# EasyEDA Pro project ELECAP.eprj, board PCB2
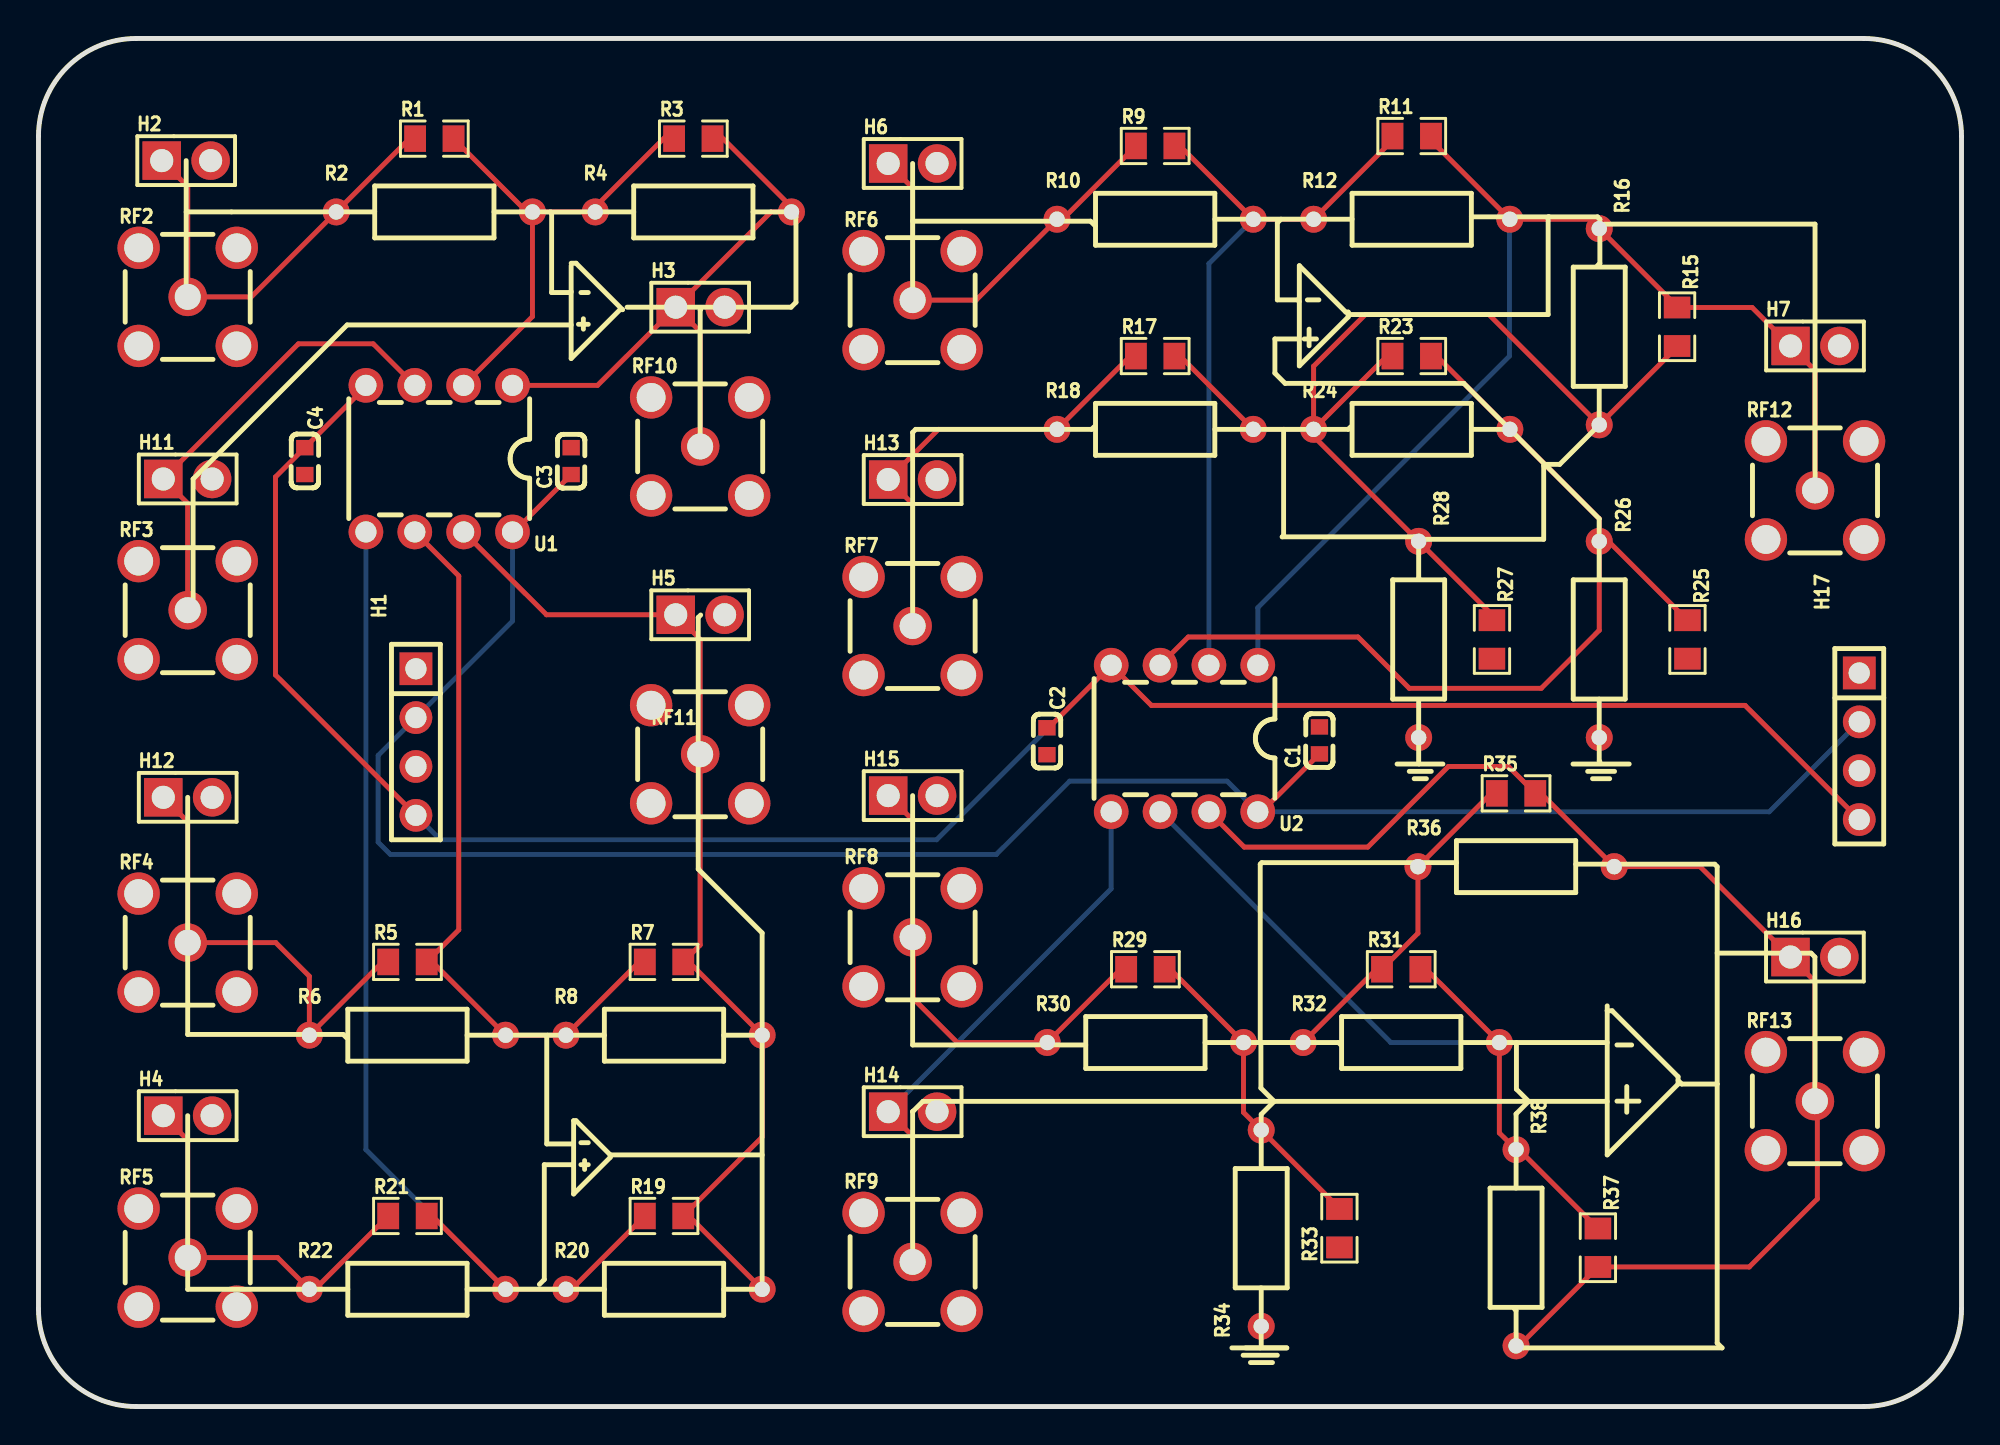
[diagram p4: board, top side]
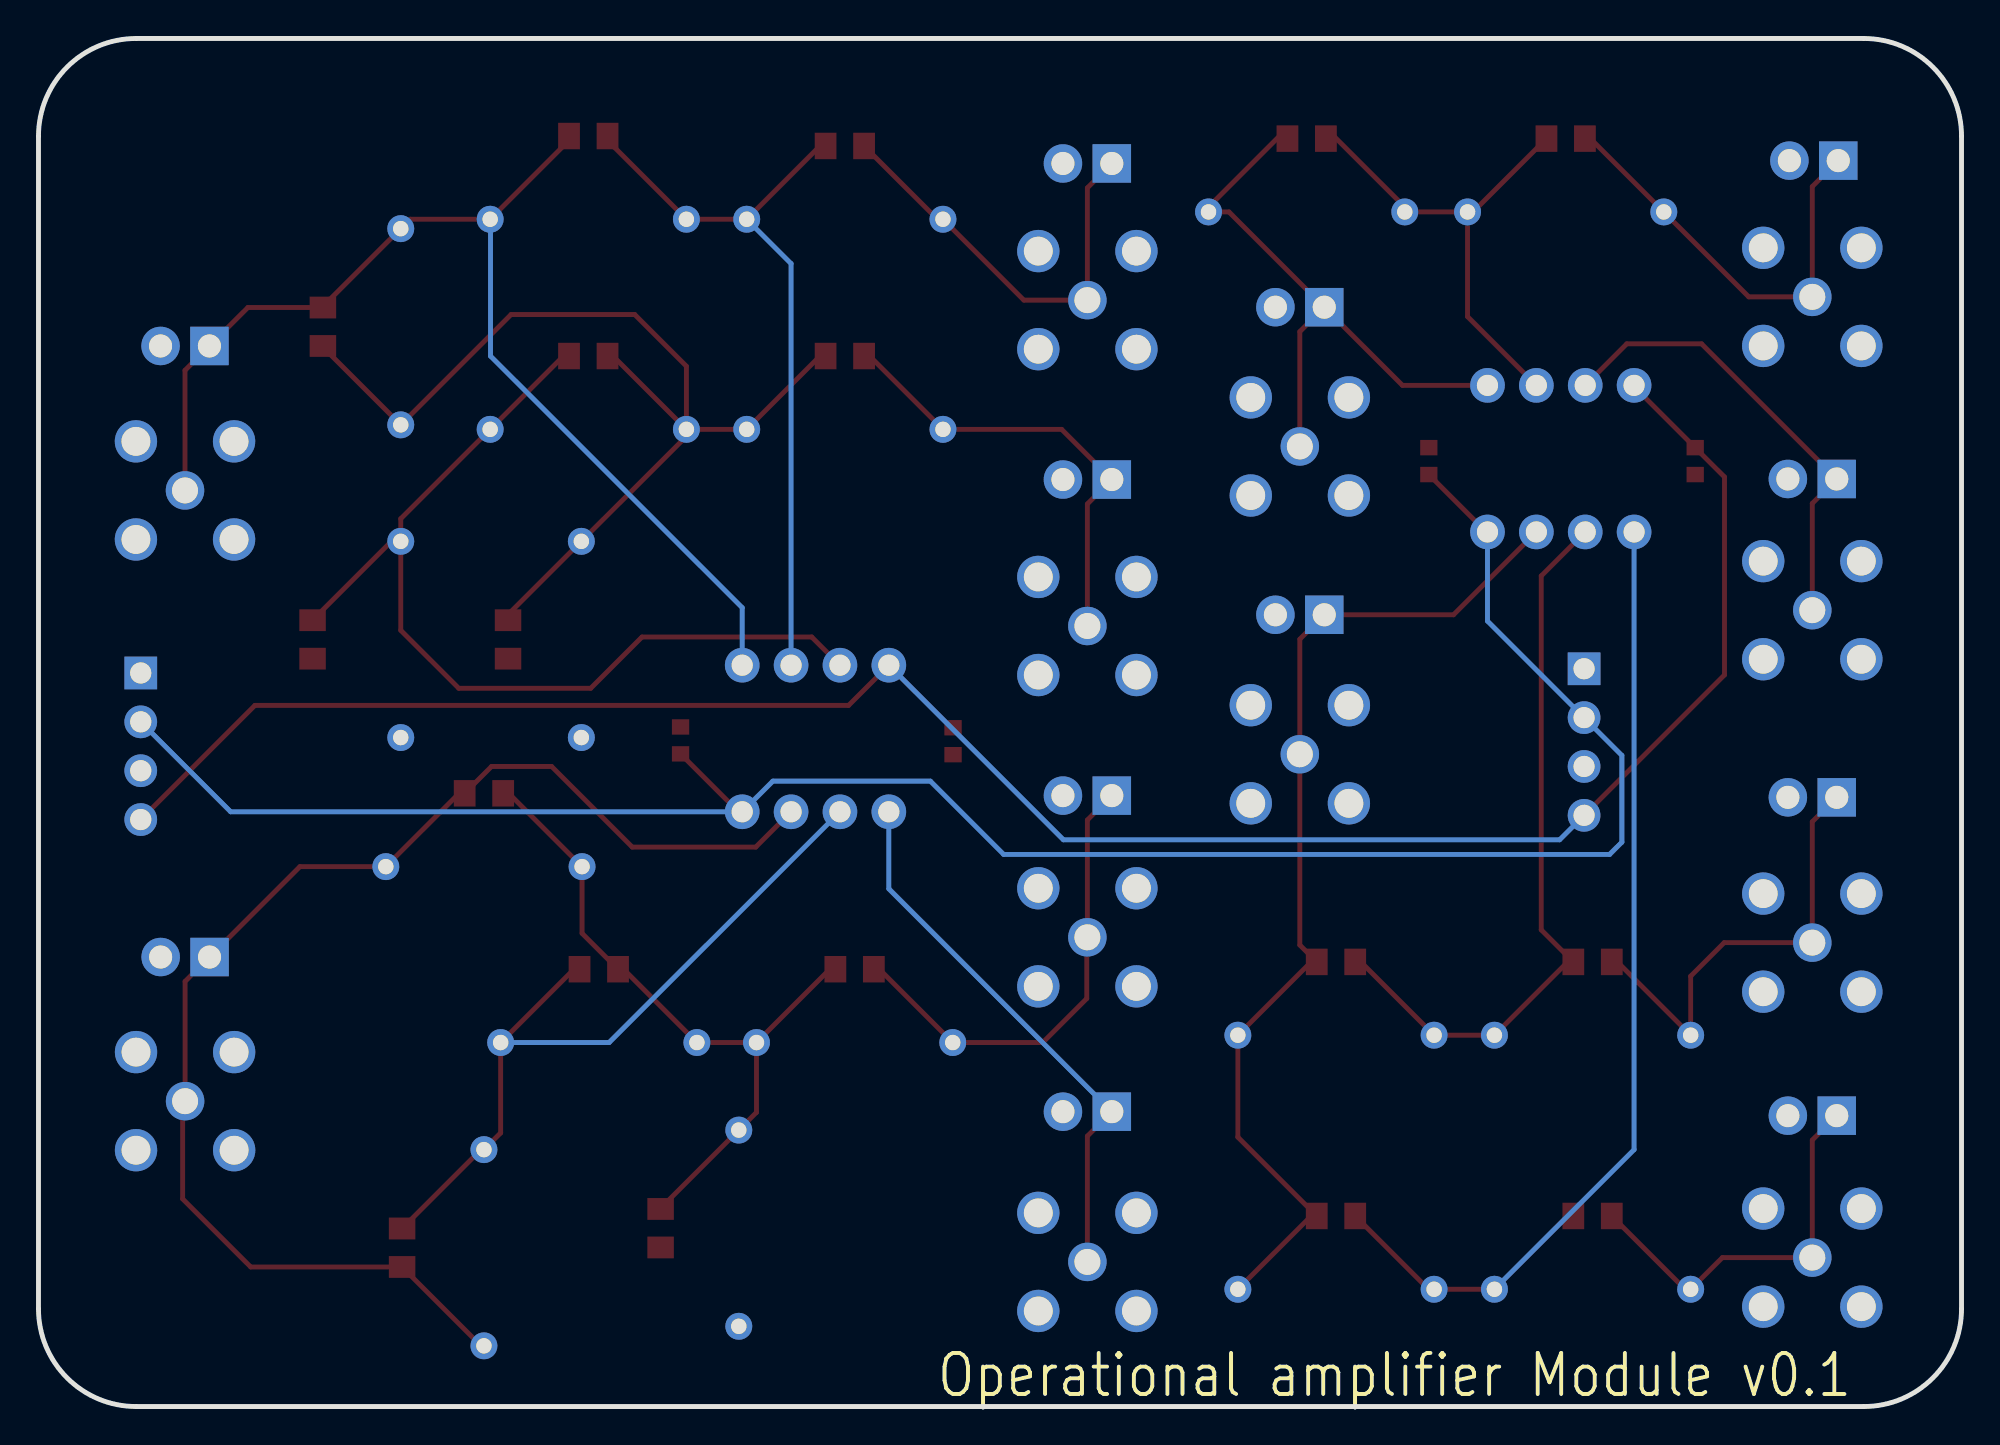
[diagram p5: board, bottom side, seen from below]

Outline 99.95 x 71.12 mm; copper layers: Top Layer, Inner9, Inner10, Inner11, Inner12, Inner13, Inner14, Inner15, Inner16, Inner17, Inner18, Inner19, Inner20, Inner21, Inner22, Inner23, Inner24, Inner25, Inner26, Inner27, Inner28, Inner29, Inner30, Bottom Layer. Coordinates in mm from the lower left corner of the outline.
Outline path: 0,66.04 0,5.08 arc(1.49,1.49) 5.08,0 94.87,0 arc(98.46,1.49) 99.95,5.08 99.95,66.04 arc(98.46,69.63) 94.87,71.12 5.08,71.12 arc(1.49,69.63) 0,66.04
Stack: Top Layer 0.035mm / Dielectric1 1.51mm FR4 er 4.5 / Bottom Layer 0.035mm

## Design rules (mm)
template: JLCPCB Capability(Two Layers Board)
spacing copperThickness1oz (default): track to track 0.102, other pairs 0.152 to 0.3
spacing copperThickness2oz: track to track 0.203, other pairs 0.152 to 0.3
track width copperThickness1oz (default): min 0.127, default 0.254, max 2.54
track width copperThickness2oz: min 0.203, default 0.254, max 2.54
differential pair differentialPair (default): width min 0.127, default 0.254, max 2.54; gap min 0.152, default 0.152
via viaSize (default): diameter min 0.5, default 0.61, max 10; hole min 0.3, default 0.305, max 6.3

## Placement (name value [footprint] x y rotation side)
C1  100nF  [C0603]  66.58 34.63 90 top
C2  100nF  [C0603]  52.41 34.59 270 top
C3  100nF  [C0603]  27.69 49.15 90 top
C4  100nF  [C0603]  13.84 49.15 270 top
H1  PZ254V-11-04P  [HDR-TH_4P-P2.54-V-M]  19.62 34.54 270 top
H2  PZ254V-11-02P  [HDR-TH_2P-P2.54-V-M]  7.68 64.77 0 top
H3  PZ254V-11-02P  [HDR-TH_2P-P2.54-V-M]  34.39 57.15 0 top
H4  PZ254V-11-02P  [HDR-TH_2P-P2.54-V-M]  7.76 15.12 0 top
H5  PZ254V-11-02P  [HDR-TH_2P-P2.54-V-M]  34.39 41.16 0 top
H6  PZ254V-11-02P  [HDR-TH_2P-P2.54-V-M]  45.43 64.62 0 top
H7  PZ254V-11-02P  [HDR-TH_2P-P2.54-V-M]  92.33 55.14 0 top
H11  PZ254V-11-02P  [HDR-TH_2P-P2.54-V-M]  7.76 48.22 0 top
H12  PZ254V-11-02P  [HDR-TH_2P-P2.54-V-M]  7.76 31.67 0 top
H13  PZ254V-11-02P  [HDR-TH_2P-P2.54-V-M]  45.43 48.19 0 top
H14  PZ254V-11-02P  [HDR-TH_2P-P2.54-V-M]  45.43 15.33 0 top
H15  PZ254V-11-02P  [HDR-TH_2P-P2.54-V-M]  45.43 31.76 0 top
H16  PZ254V-11-02P  [HDR-TH_2P-P2.54-V-M]  92.33 23.37 0 top
H17  PZ254V-11-04P  [HDR-TH_4P-P2.54-V-M]  94.63 34.32 270 top
R1  1kΩ  [R0805]  20.57 65.91 0 top
R2  1kΩ  [RES-TH_BD2.7-L6.2-P10.20-D0.4]  20.57 62.1 0 top
R3  1kΩ  [R0805]  34.04 65.91 0 top
R4  1kΩ  [RES-TH_BD2.7-L6.2-P10.20-D0.4]  34.04 62.1 0 top
R5  1kΩ  [R0805]  19.18 23.11 0 top
R6  1kΩ  [RES-TH_BD2.7-L6.2-P10.20-D0.4]  19.18 19.3 0 top
R7  1kΩ  [R0805]  32.51 23.11 0 top
R8  1kΩ  [RES-TH_BD2.7-L6.2-P10.20-D0.4]  32.51 19.3 0 top
R9  1kΩ  [R0805]  58.04 65.53 0 top
R10  1kΩ  [RES-TH_BD2.7-L6.2-P10.20-D0.4]  58.04 61.72 0 top
R11  1kΩ  [R0805]  71.37 66.05 0 top
R12  1kΩ  [RES-TH_BD2.7-L6.2-P10.20-D0.4]  71.37 61.72 0 top
R15  1kΩ  [R0805]  85.17 56.13 270 top
R16  1kΩ  [RES-TH_BD2.7-L6.2-P10.20-D0.4]  81.12 56.13 270 top
R17  1kΩ  [R0805]  58.04 54.61 0 top
R18  1kΩ  [RES-TH_BD2.7-L6.2-P10.20-D0.4]  58.04 50.8 0 top
R19  1kΩ  [R0805]  32.51 9.91 0 top
R20  1kΩ  [RES-TH_BD2.7-L6.2-P10.20-D0.4]  32.51 6.1 0 top
R21  1kΩ  [R0805]  19.18 9.91 0 top
R22  1kΩ  [RES-TH_BD2.7-L6.2-P10.20-D0.4]  19.18 6.1 0 top
R23  1kΩ  [R0805]  71.37 54.61 0 top
R24  1kΩ  [RES-TH_BD2.7-L6.2-P10.20-D0.4]  71.37 50.8 0 top
R25  1kΩ  [R0805]  85.7 39.88 90 top
R26  1kΩ  [RES-TH_BD2.7-L6.2-P10.20-D0.4]  81.12 39.88 90 top
R27  1kΩ  [R0805]  75.54 39.88 270 top
R28  1kΩ  [RES-TH_BD2.7-L6.2-P10.20-D0.4]  71.73 39.88 270 top
R29  1kΩ  [R0805]  57.53 22.73 0 top
R30  1kΩ  [RES-TH_BD2.7-L6.2-P10.20-D0.4]  57.53 18.92 0 top
R31  1kΩ  [R0805]  70.83 22.73 0 top
R32  1kΩ  [RES-TH_BD2.7-L6.2-P10.20-D0.4]  70.83 18.92 0 top
R33  1kΩ  [R0805]  67.61 9.27 90 top
R34  1kΩ  [RES-TH_BD2.7-L6.2-P10.20-D0.4]  63.55 9.27 90 top
R35  1kΩ  [R0805]  76.8 31.88 0 top
R36  1kΩ  [RES-TH_BD2.7-L6.2-P10.20-D0.4]  76.8 28.07 0 top
R37  1kΩ  [R0805]  81.05 8.26 270 top
R38  1kΩ  [RES-TH_BD2.7-L6.2-P10.20-D0.4]  76.8 8.26 270 top
RF2  BWSMA-KE-Z001  [SMA-TH_BWSMA-KE-Z001]  7.76 57.69 0 top
RF3  BWSMA-KE-Z001  [SMA-TH_BWSMA-KE-Z001]  7.76 41.4 0 top
RF4  BWSMA-KE-Z001  [SMA-TH_BWSMA-KE-Z001]  7.76 24.12 0 top
RF5  BWSMA-KE-Z001  [SMA-TH_BWSMA-KE-Z001]  7.76 7.74 0 top
RF6  BWSMA-KE-Z001  [SMA-TH_BWSMA-KE-Z001]  45.43 57.52 0 top
RF7  BWSMA-KE-Z001  [SMA-TH_BWSMA-KE-Z001]  45.43 40.58 0 top
RF8  BWSMA-KE-Z001  [SMA-TH_BWSMA-KE-Z001]  45.43 24.39 0 top
RF9  BWSMA-KE-Z001  [SMA-TH_BWSMA-KE-Z001]  45.43 7.52 0 top
RF10  BWSMA-KE-Z001  [SMA-TH_BWSMA-KE-Z001]  34.39 49.91 0 top
RF11  BWSMA-KE-Z001  [SMA-TH_BWSMA-KE-Z001]  34.39 33.91 0 top
RF12  BWSMA-KE-Z001  [SMA-TH_BWSMA-KE-Z001]  92.33 47.63 0 top
RF13  BWSMA-KE-Z001  [SMA-TH_BWSMA-KE-Z001]  92.33 15.88 0 top
U1  LM358N(XBLW)  [PDIP-8_L9.3-W6.4-P2.54-LS7.6-BL]  20.83 49.28 180 top
U2  LM358N(XBLW)  [PDIP-8_L9.3-W6.4-P2.54-LS7.6-BL]  59.56 34.73 180 top

## Footprints (pads in the part's own frame, mm; a bottom-side part is the same pattern mirrored in y, then rotated)
C0603
  rect 0.8x0.9 smd: 1(-0.7,0) 2(0.7,0)
HDR-TH_2P-P2.54-V-M
  rect 2x2 hole 1.2: 1(-1.27,0)
  round 2 hole 1.2: 2(1.27,0)
HDR-TH_4P-P2.54-V-M
  rect 1.7x1.7 hole 1.1: 1(-3.81,0)
  round 1.7 hole 1.1: 2(-1.27,0) 3(1.27,0) 4(3.81,0)
PDIP-8_L9.3-W6.4-P2.54-LS7.6-BL
  round 1.8 hole 1.1: 1(-3.81,-3.81) 2(-1.27,-3.81) 3(1.27,-3.81) 4(3.81,-3.81) 5(3.81,3.81) 6(1.27,3.81) 7(-1.27,3.81) 8(-3.81,3.81)
R0805
  rect 1.133x1.377 smd: 1(-1,0) 2(1,0)
RES-TH_BD2.7-L6.2-P10.20-D0.4
  round 1.4 hole 0.8: 1(-5.1,0) 2(5.1,0)
SMA-TH_BWSMA-KE-Z001
  round 2.2 hole 1.5: 1(-2.55,-2.55) 2(-2.55,2.55) 3(2.55,2.55) 4(2.55,-2.55)
  round 2 hole 1.35: 5(0,0)

## Nets
As in the schematic.

## Routing (per net, layer and track width the routed paths; a pad name or vN(x,y) marks a point on that pad's centre or on a via; arc(x,y) is an arc through that point)
+5V: length 109.2
  Top Layer w0.254: C3.1 24.7,45.47 U1.8 ; U2.8 63.57,30.92 C1.1
  Bottom Layer w0.254: U1.8 24.64,40.83 H1.2 17.65,33.85 17.65,29.34 18.29,28.7 49.78,28.7 53.59,32.51 61.78,32.51 U2.8 89.96,30.92 H17.2
-5V: length 114.6
  Top Layer w0.254: U1.4 17.02,53.02 C4.1 12.32,48.33 12.32,38.03 H1.4 ; C2.1 52.5,35.29 U2.4 57.84,36.45 88.7,36.45 H17.4
  Bottom Layer w0.254: U2.4 46.68,29.46 20.89,29.46 H1.4
$1N792: length 22.9
  Top Layer w0.254: H2.1 7.76,63.42 RF2.5 11.06,57.69 R2.1 19.28,65.91 R1.1
$1N806: length 25.1
  Top Layer w0.254: 28.94,62.36 32.75,66.17 33.04,66.17 ; 25.67,62.1 28.94,62.1 ; 25.67,62.1 25.67,56.66 U1.2 ; 25.67,62.1 25.38,62.1 R1.2
$1N1003: length 31.7
  Top Layer w0.254: 35.04,66.17 35.33,66.17 39.14,62.36 ; R4.2 38.07,62.1 H3.1 ; H3.1 34.39,55.88 RF10.5 ; H3.1 29.06,53.09 U1.1
$1N1486: length 23.9
  Top Layer w0.254: R5.1 17.89,23.11 R6.1 14.08,22.37 12.33,24.12 RF4.5 7.76,30.4 H12.1
$1N1503: length 38.5
  Top Layer w0.254: R7.1 31.22,23.11 27.41,19.3 R6.2 20.47,23.11 R5.2 21.84,24.78 21.84,43.18 U1.6
$1N2007: length 22.6
  Top Layer w0.254: R9.1 53.23,61.72 R10.1 48.73,57.52 RF6.5 45.43,63.35 H6.1
$1N2050: length 39
  Top Layer w0.254: R11.1 70.37,65.82 R12.1 R10.2 59.33,65.53 R9.2
  Bottom Layer w0.254: U2.2 60.83,59.42 R10.2
$1N2612: length 23.7
  Top Layer w0.254: R17.1 56.75,54.61 R18.1 46.77,50.8 H13.1 45.43,46.92 RF7.5
$1N3257: length 24.2
  Top Layer w0.254: RF3.5 7.76,46.95 H11.1 13.51,55.25 17.4,55.25 U1.3
$1N3415: length 56.9
  Top Layer w0.254: R21.2 20.47,9.91 R22.2 27.7,6.1 R19.1
  Bottom Layer w0.254: U1.5 17.02,13.36 R22.2
$1N3432: length 54.2
  Top Layer w0.254: U1.7 26.4,41.16 H5.1 34.39,39.89 RF11.5 34.39,23.99 R7.2 33.8,23.11 R8.2 37.61,14.01 R19.2 33.8,9.91 R20.2
$1N3534: length 20.6
  Top Layer w0.254: H4.1 7.76,13.85 RF5.5 12.43,7.74 R22.1 14.37,6.1 R21.1
$1N4070: length 50.1
  Top Layer w0.254: R25.2 81.6,44.98 R26.2 ; R26.2 81.12,46.15 R24.2 72.66,54.61 R23.2 ; R26.2 81.12,40.35 78.11,37.34 71.25,37.34 68.58,40.01 59.76,40.01 U2.3
$1N4142: length 60
  Top Layer w0.254: R11.2 72.37,65.82 R12.2 80.63,61.72 R16.1 85.17,57.19 R15.1 89.07,57.13 H7.1 92.33,53.87 RF12.5
  Bottom Layer w0.254: R12.2 76.45,61.7 76.45,54.61 63.37,41.53 U2.1
$1N4280: length 55.6
  Top Layer w0.254: R24.1 R18.2 59.33,54.61 R17.2 ; R24.1 70.08,54.61 R23.1 ; R24.1 66.27,54.08 68.96,56.77 75.39,56.77 81.12,51.03 85.17,55.08 R15.2 ; R24.1 66.27,50.44 R28.1 75.54,41.17 R27.1
$1N4445: length 28.7
  Top Layer w0.254: RF9.5 45.43,14.06 H14.1
  Bottom Layer w0.254: H14.1 55.75,26.92 U2.5
$1N5039: length 37
  Top Layer w0.254: R29.2 58.82,22.73 R30.2 ; R30.2 65.73,18.92 69.54,22.73 R31.1 71.7,24.6 R36.1 75.51,31.88 R35.1 ; R30.2 62.63,15.29 R34.2 67.61,10.31 R33.2
$1N5066: length 40.2
  Top Layer w0.254: R31.2 72.12,22.73 R32.2 75.93,14.22 R38.1 76.95,13.36 R37.1
  Bottom Layer w0.254: U2.6 70.29,18.92 R32.2
$1N5138: length 68.8
  Top Layer w0.254: U2.7 62.67,29.08 69.09,29.08 73.28,33.27 76.4,33.27 R35.2 78.09,31.88 R36.2 86.36,28.07 H16.1 92.33,22.1 RF13.5 92.46,15.75 92.46,10.8 88.92,7.26 R37.2 76.95,3.16 R38.2
$1N6045: length 24.7
  Top Layer w0.254: R29.1 56.24,22.73 R30.1 47.75,18.92 45.47,21.21 45.47,24.36 RF8.5 45.43,30.49 H15.1

## Copper pours and planes (outline as drawn; the poured copper is in the pictures)
GND on Top Layer: -3.94,74.04 107.19,74.04 107.19,-3.81 -3.94,-3.81
GND on Bottom Layer: -18.41,82.42 119.13,82.42 119.13,-15.49 -18.41,-15.49

## Text on the board
Bottom Silkscreen Layer: Operational amplifier Module v0.1
